# Altium schematic sheet Microcontroller.SchDoc: Microcontroller
size B; DrawnBy: Jasper Yun; SheetNumber: 5; SheetTotal: 13; Competition: SAC 2021; Subteam: Avionics; University: McGill University; Location: Montreal, Quebec; Project: Avionics Project Name; MRT: McGill Rocket Team
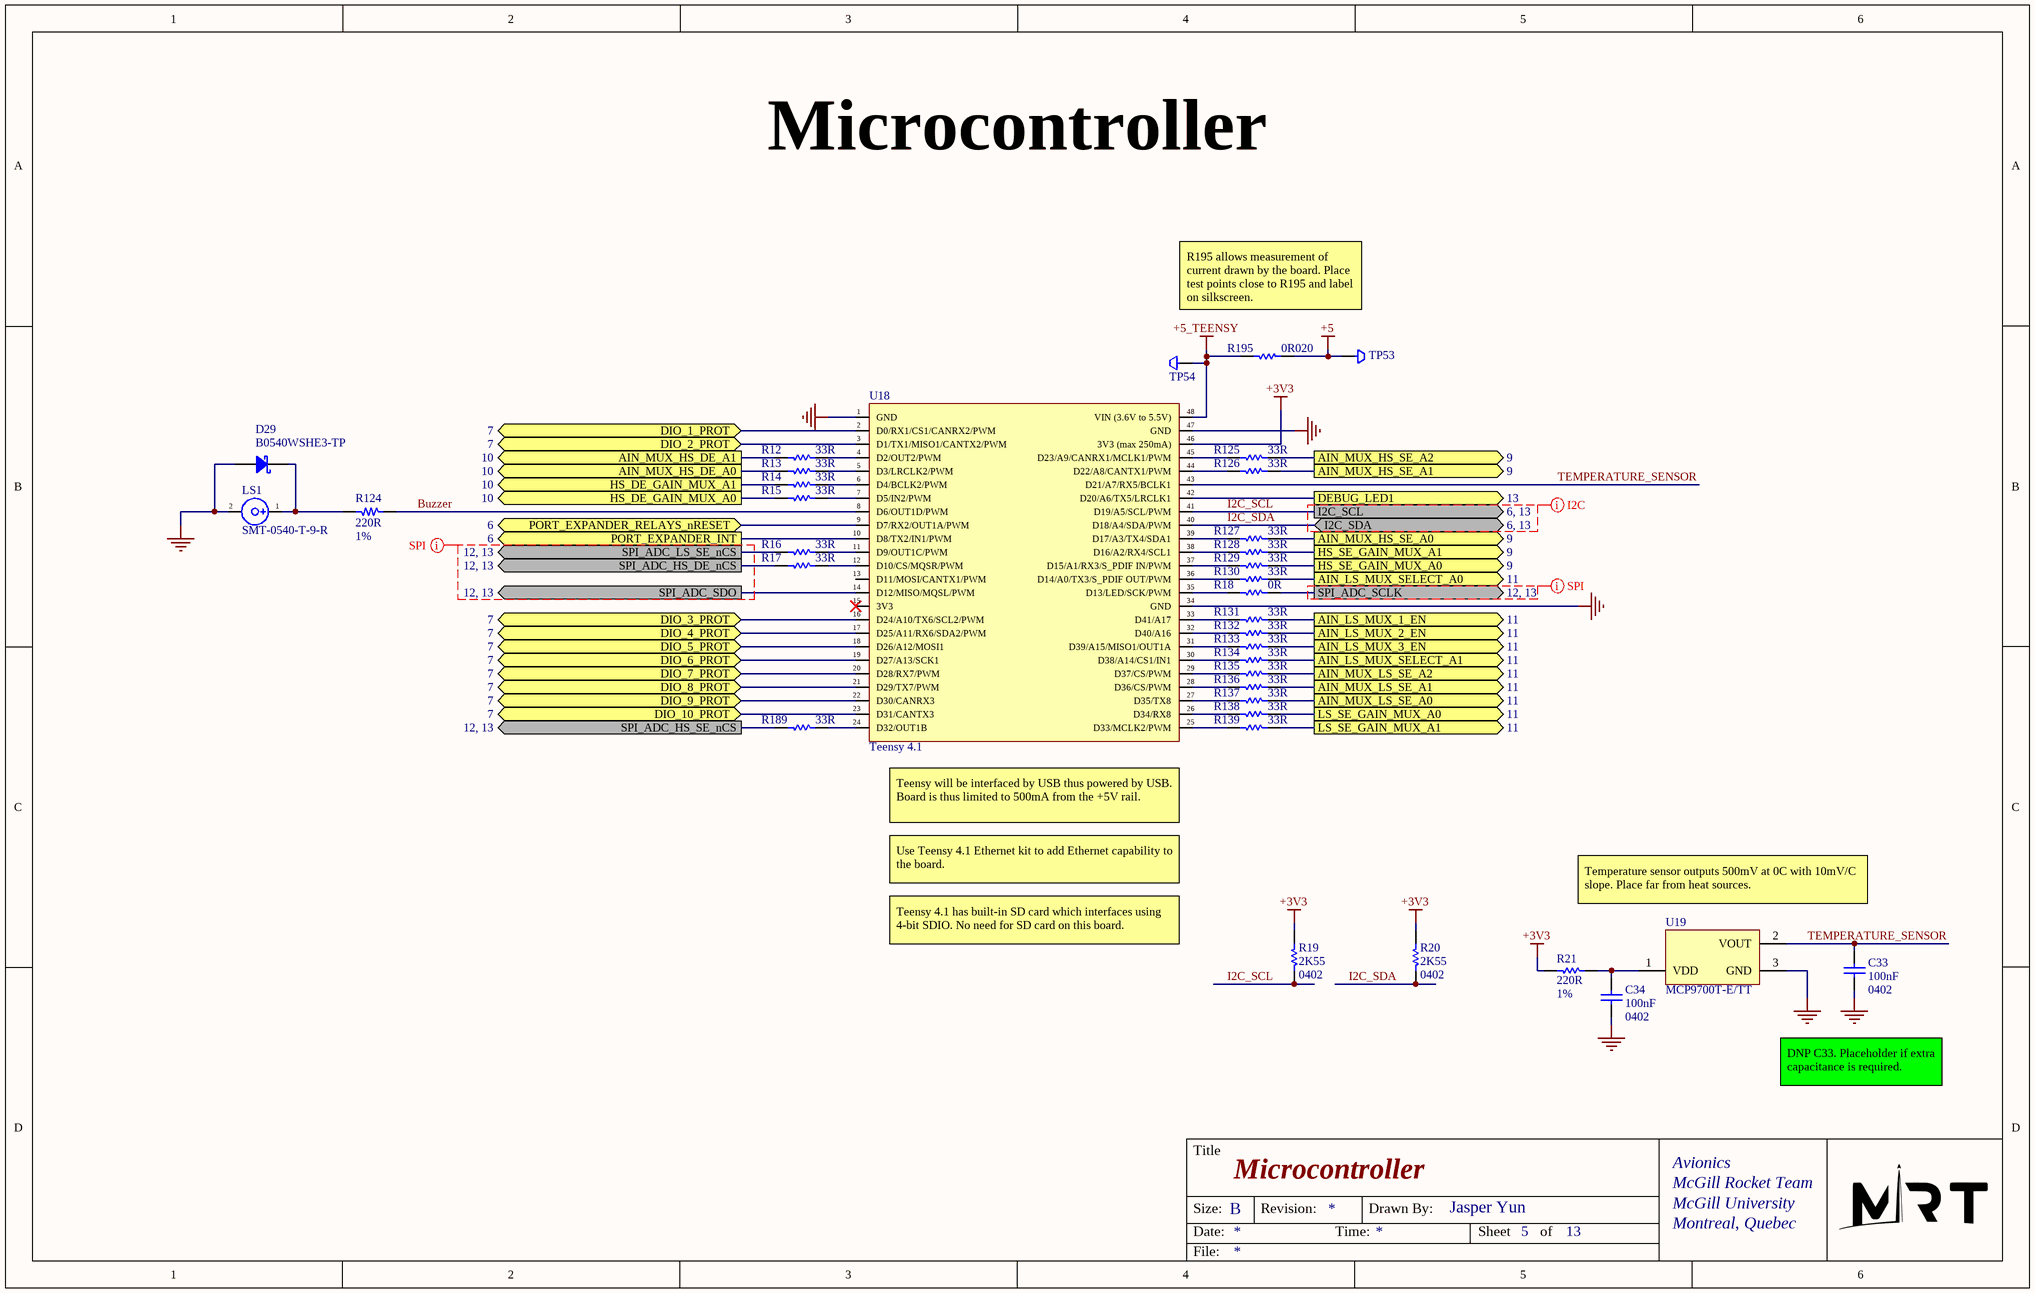
[diagram p0: Microcontroller.SchDoc]

## Parts
C33  100nF  value 0402  [0402 CAP]
C34  100nF  value 0402  [0402 CAP]
D29  B0540WSHE3-TP  [Diode SOD323-F]
LS1  SMT-0540-T-9-R  [Buzzer SMT-0540-T-9-R]
R12  33R  [0402 RES]
R13  33R  [0402 RES]
R14  33R  [0402 RES]
R15  33R  [0402 RES]
R16  33R  [0402 RES]
R17  33R  [0402 RES]
R18  0R  [0402 RES]
R19  2K55  value 0402  [0402 RES]
R20  2K55  value 0402  [0402 RES]
R21  220R  value 1%  [0402 RES]
R124  220R  Tolerance: 1%  [0402 RES]
R125  33R  [0402 RES]
R126  33R  [0402 RES]
R127  33R  [0402 RES]
R128  33R  [0402 RES]
R129  33R  [0402 RES]
R130  33R  [0402 RES]
R131  33R  [0402 RES]
R132  33R  [0402 RES]
R133  33R  [0402 RES]
R134  33R  [0402 RES]
R135  33R  [0402 RES]
R136  33R  [0402 RES]
R137  33R  [0402 RES]
R138  33R  [0402 RES]
R139  33R  [0402 RES]
R189  33R  [0402 RES]
R195  0R020  [0805 RES]
TP53  Test Point - Keystone 5015  [Test Point Keystone 5015]  (value not drawn)
TP54  Test Point - Keystone 5015  [Test Point Keystone 5015]  (value not drawn)
U18  Teensy 4.1  [Teensy 4.1]
U19  MCP9700T-E/TT  [SOT-23-TT3_M]

## Ports
AIN_LS_MUX_1_EN (out, see 11), AIN_LS_MUX_2_EN (out, see 11), AIN_LS_MUX_3_EN (out, see 11), AIN_LS_MUX_SELECT_A0 (out, see 11), AIN_LS_MUX_SELECT_A1 (out, see 11), AIN_MUX_HS_DE_A0 (out, see 10), AIN_MUX_HS_DE_A1 (out, see 10), AIN_MUX_HS_SE_A0 (out, see 9), AIN_MUX_HS_SE_A1 (out, see 9), AIN_MUX_HS_SE_A2 (out, see 9), AIN_MUX_LS_SE_A0 (out, see 11), AIN_MUX_LS_SE_A1 (out, see 11), AIN_MUX_LS_SE_A2 (out, see 11), DEBUG_LED1 (out, see 13), DIO_1_PROT (bidir, see 7), DIO_2_PROT (bidir, see 7), DIO_3_PROT (bidir, see 7), DIO_4_PROT (bidir, see 7), DIO_5_PROT (bidir, see 7), DIO_6_PROT (bidir, see 7), DIO_7_PROT (bidir, see 7), DIO_8_PROT (bidir, see 7), DIO_9_PROT (bidir, see 7), DIO_10_PROT (bidir, see 7), HS_DE_GAIN_MUX_A0 (out, see 10), HS_DE_GAIN_MUX_A1 (out, see 10), HS_SE_GAIN_MUX_A0 (out, see 9), HS_SE_GAIN_MUX_A1 (out, see 9), I2C_SCL (out, see 6, 13), I2C_SDA (bidir, see 6, 13), LS_SE_GAIN_MUX_A0 (out, see 11), LS_SE_GAIN_MUX_A1 (out, see 11), PORT_EXPANDER_INT (out, see 6), PORT_EXPANDER_RELAYS_nRESET (bidir, see 6), SPI_ADC_HS_DE_nCS (out, see 12, 13), SPI_ADC_HS_SE_nCS (out, see 12, 13), SPI_ADC_LS_SE_nCS (out, see 12, 13), SPI_ADC_SCLK (out, see 12, 13), SPI_ADC_SDO (out, see 12, 13)

## Nets
+3V3: R19.1 R20.1 R21.1 U18.46(3V3_(max_250mA))
+5: R195.2 TP53.1
+5_TEENSY: R195.1 TP54.1 U18.48(VIN_(3.6V_to_5.5V))
GND: C33.1 C34.1 D29.1 LS1.2(K) U18.1(GND) U18.34(GND) U18.47(GND) U19.3(GND)
AIN_LS_MUX_1_EN: R131.2 ; port AIN_LS_MUX_1_EN
AIN_LS_MUX_2_EN: R132.2 ; port AIN_LS_MUX_2_EN
AIN_LS_MUX_3_EN: R133.2 ; port AIN_LS_MUX_3_EN
AIN_LS_MUX_SELECT_A0: R130.2 ; port AIN_LS_MUX_SELECT_A0
AIN_LS_MUX_SELECT_A1: R134.2 ; port AIN_LS_MUX_SELECT_A1
AIN_MUX_HS_DE_A0: R13.1 ; port AIN_MUX_HS_DE_A0
AIN_MUX_HS_DE_A1: R12.1 ; port AIN_MUX_HS_DE_A1
AIN_MUX_HS_SE_A0: R127.2 ; port AIN_MUX_HS_SE_A0
AIN_MUX_HS_SE_A1: R126.2 ; port AIN_MUX_HS_SE_A1
AIN_MUX_HS_SE_A2: R125.2 ; port AIN_MUX_HS_SE_A2
AIN_MUX_LS_SE_A0: R137.2 ; port AIN_MUX_LS_SE_A0
AIN_MUX_LS_SE_A1: R136.2 ; port AIN_MUX_LS_SE_A1
AIN_MUX_LS_SE_A2: R135.2 ; port AIN_MUX_LS_SE_A2
Buzzer: R124.1 U18.8(D6/OUT1D/PWM)
DEBUG_LED1: U18.42(D20/A6/TX5/LRCLK1) ; port DEBUG_LED1
DIO_1_PROT: U18.2(D0/RX1/CS1/CANRX2/PWM) ; port DIO_1_PROT
DIO_2_PROT: U18.3(D1/TX1/MISO1/CANTX2/PWM) ; port DIO_2_PROT
DIO_3_PROT: U18.16(D24/A10/TX6/SCL2/PWM) ; port DIO_3_PROT
DIO_4_PROT: U18.17(D25/A11/RX6/SDA2/PWM) ; port DIO_4_PROT
DIO_5_PROT: U18.18(D26/A12/MOSI1) ; port DIO_5_PROT
DIO_6_PROT: U18.19(D27/A13/SCK1) ; port DIO_6_PROT
DIO_7_PROT: U18.20(D28/RX7/PWM) ; port DIO_7_PROT
DIO_8_PROT: U18.21(D29/TX7/PWM) ; port DIO_8_PROT
DIO_9_PROT: U18.22(D30/CANRX3) ; port DIO_9_PROT
DIO_10_PROT: U18.23(D31/CANTX3) ; port DIO_10_PROT
HS_DE_GAIN_MUX_A0: R15.1 ; port HS_DE_GAIN_MUX_A0
HS_DE_GAIN_MUX_A1: R14.1 ; port HS_DE_GAIN_MUX_A1
HS_SE_GAIN_MUX_A0: R129.2 ; port HS_SE_GAIN_MUX_A0
HS_SE_GAIN_MUX_A1: R128.2 ; port HS_SE_GAIN_MUX_A1
I2C_SCL: R19.2 U18.41(D19/A5/SCL/PWM) ; port I2C_SCL
I2C_SDA: R20.2 U18.40(D18/A4/SDA/PWM) ; port I2C_SDA
LS_SE_GAIN_MUX_A0: R138.2 ; port LS_SE_GAIN_MUX_A0
LS_SE_GAIN_MUX_A1: R139.2 ; port LS_SE_GAIN_MUX_A1
PORT_EXPANDER_INT: U18.10(D8/TX2/IN1/PWM) ; port PORT_EXPANDER_INT
PORT_EXPANDER_RELAYS_nRESET: U18.9(D7/RX2/OUT1A/PWM) ; port PORT_EXPANDER_RELAYS_nRESET
SPI_ADC_HS_DE_nCS: R17.1 ; port SPI_ADC_HS_DE_nCS
SPI_ADC_HS_SE_nCS: R189.1 ; port SPI_ADC_HS_SE_nCS
SPI_ADC_LS_SE_nCS: R16.1 ; port SPI_ADC_LS_SE_nCS
SPI_ADC_SCLK: R18.2 ; port SPI_ADC_SCLK
SPI_ADC_SDO: U18.14(D12/MISO/MQSL/PWM) ; port SPI_ADC_SDO
TEMPERATURE_SENSOR: C33.2 U18.43(D21/A7/RX5/BCLK1) U19.2(VOUT)
NetC34_2: C34.2 R21.2 U19.1(VDD)
NetD29_2: D29.2 LS1.1(A) R124.2
NetR12_2: R12.2 U18.4(D2/OUT2/PWM)
NetR13_2: R13.2 U18.5(D3/LRCLK2/PWM)
NetR14_2: R14.2 U18.6(D4/BCLK2/PWM)
NetR15_2: R15.2 U18.7(D5/IN2/PWM)
NetR16_2: R16.2 U18.11(D9/OUT1C/PWM)
NetR17_2: R17.2 U18.12(D10/CS/MQSR/PWM)
NetR18_1: R18.1 U18.35(D13/LED/SCK/PWM)
NetR125_1: R125.1 U18.45(D23/A9/CANRX1/MCLK1/PWM)
NetR126_1: R126.1 U18.44(D22/A8/CANTX1/PWM)
NetR127_1: R127.1 U18.39(D17/A3/TX4/SDA1)
NetR128_1: R128.1 U18.38(D16/A2/RX4/SCL1)
NetR129_1: R129.1 U18.37(D15/A1/RX3/S_PDIF_IN/PWM)
NetR130_1: R130.1 U18.36(D14/A0/TX3/S_PDIF_OUT/PWM)
NetR131_1: R131.1 U18.33(D41/A17)
NetR132_1: R132.1 U18.32(D40/A16)
NetR133_1: R133.1 U18.31(D39/A15/MISO1/OUT1A)
NetR134_1: R134.1 U18.30(D38/A14/CS1/IN1)
NetR135_1: R135.1 U18.29(D37/CS/PWM)
NetR136_1: R136.1 U18.28(D36/CS/PWM)
NetR137_1: R137.1 U18.27(D35/TX8)
NetR138_1: R138.1 U18.26(D34/RX8)
NetR139_1: R139.1 U18.25(D33/MCLK2/PWM)
NetR189_2: R189.2 U18.24(D32/OUT1B)

Not connected (* = marked no-connect by the designer): U18 13(D11/MOSI/CANTX1/PWM) 15(3V3)*

## Layout directives
net class I2C: (no net found under the mark)
net class SPI: (no net found under the mark)

## Notes on the sheet
- R195 allows measurement of current drawn by the board. Place test points close to R195 and label on silkscreen.
- (near U18) Teensy will be interfaced by USB thus powered by USB. Board is thus limited to 500mA from the +5V rail.
- Use Teensy 4.1 Ethernet kit to add Ethernet capability to the board.
- Temperature sensor outputs 500mV at 0C with 10mV/C slope. Place far from heat sources.
- Teensy 4.1 has built-in SD card which interfaces using 4-bit SDIO. No need for SD card on this board.
- DNP C33. Placeholder if extra capacitance is required.
- Title
- Size:
- Date:
- B
- Revision:
- Time:
- Drawn By:
- Sheet
- of
- File:

## Library data of the parts
C33 C34 = Cap: Capacitor; Published: 8-Jun-2000; LatestRevisionDate: 17-Jul-2002; LatestRevisionNote: Re-released for DXP Platform.; PackageReference: RAD-0.3; Publisher: Altium Limited; PackageDescription: Radial Cap, Thru-Hole; 2 Leads; 0.3 in Pin Spacing
D29 = Diode Schottky: Generic Schottky Diode
LS1 = Buzzer HNB09A05: CMT-9648-85T / Magnetic buzzer
R12-R18 R125-R139 R189 R195 = Res1: Resistor; Value: 1%; Published: 8-Jun-2000; LatestRevisionDate: 17-Jul-2002; LatestRevisionNote: Re-released for DXP Platform.; PackageReference: AXIAL-0.3; Publisher: Altium Limited; PackageDescription: Axial Device, Thru-Hole; 2 Leads; 0.3 in Pin Spacing
R19-R21 = Res1: Resistor; Published: 8-Jun-2000; LatestRevisionDate: 17-Jul-2002; LatestRevisionNote: Re-released for DXP Platform.; PackageReference: AXIAL-0.3; Publisher: Altium Limited; PackageDescription: Axial Device, Thru-Hole; 2 Leads; 0.3 in Pin Spacing
R124 = Resistor: Generic resistor
TP53 TP54 = Test Point - Keystone 5015: Keystone 5015 Test point
U18 = Teensy 4.1: Teensy 4.1 breakout (no ethernet or USB host pins exposed)
U19 = CMP-0192-00220-1: Low-Power Linear Active Thermistor IC, 3-Pin SOT-23, Extended Temperature, Tape and Reel; DatasheetVersion: revE, Apr-2009; PackageVersion: revBB, Aug-2009; PackageReference: SOT-23-TT3; Code_IPC: SOT23-3; PackageDescription: 3-Lead Plastic Small Outline Transistor (TT) [SOT-23]